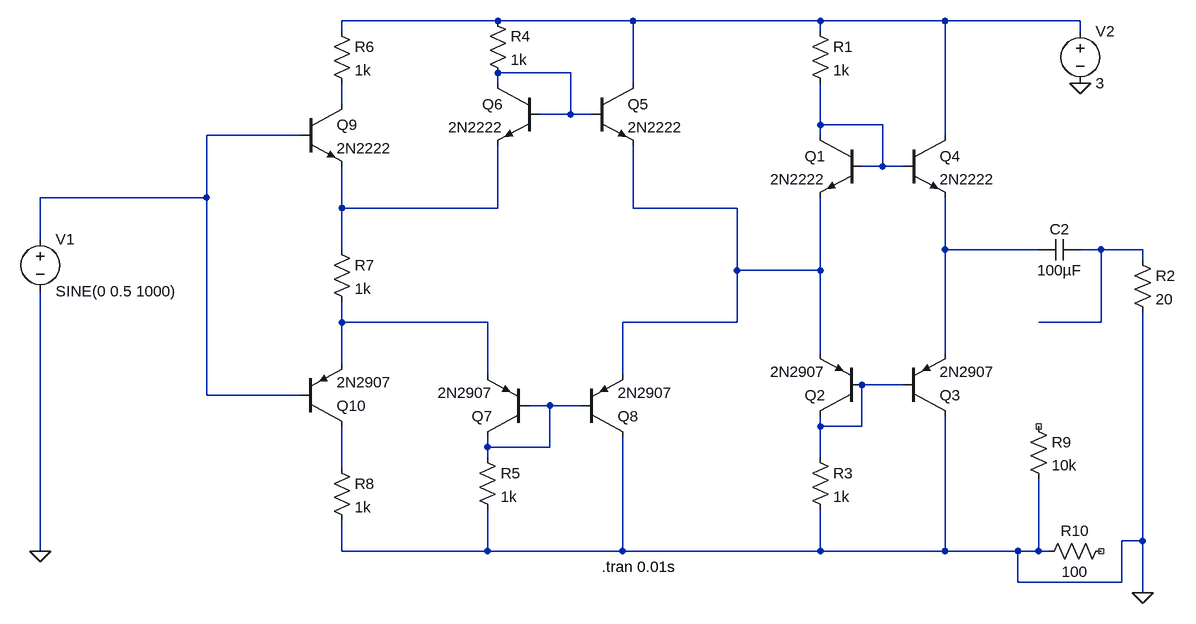
[diagram p0: schematic Final-PowerAmp.asc]
Final-PowerAmp.asc, the LTspice schematic file:
Version 4
SHEET 1 1160 800
WIRE -256 -96 -496 -96
WIRE -48 -96 -256 -96
WIRE 240 -96 -48 -96
WIRE 432 -96 240 -96
WIRE 640 -96 432 -96
WIRE -496 -80 -496 -96
WIRE 240 -80 240 -96
WIRE 640 -80 640 -96
WIRE -144 -16 -256 -16
WIRE -256 0 -256 -16
WIRE -48 0 -48 -96
WIRE -496 32 -496 0
WIRE -144 48 -144 -16
WIRE -144 48 -192 48
WIRE -112 48 -144 48
WIRE 240 64 240 0
WIRE 336 64 240 64
WIRE -560 80 -704 80
WIRE 240 80 240 64
WIRE 432 80 432 -96
WIRE 336 128 336 64
WIRE 336 128 304 128
WIRE 368 128 336 128
WIRE -704 176 -704 80
WIRE -704 176 -960 176
WIRE -496 192 -496 128
WIRE -256 192 -256 96
WIRE -256 192 -496 192
WIRE -48 192 -48 96
WIRE 112 192 -48 192
WIRE -960 240 -960 176
WIRE -496 256 -496 192
WIRE 432 256 432 176
WIRE 576 256 432 256
WIRE 672 256 640 256
WIRE 736 256 672 256
WIRE 736 272 736 256
WIRE 112 288 112 192
WIRE 240 288 240 176
WIRE 240 288 112 288
WIRE -496 368 -496 336
WIRE -272 368 -496 368
WIRE 112 368 112 288
WIRE 112 368 -64 368
WIRE 672 368 672 256
WIRE 672 368 576 368
WIRE 240 416 240 288
WIRE 432 416 432 256
WIRE -496 432 -496 368
WIRE -272 448 -272 368
WIRE -64 448 -64 368
WIRE 368 464 304 464
WIRE -704 480 -704 176
WIRE -560 480 -704 480
WIRE -176 496 -208 496
WIRE -128 496 -176 496
WIRE 240 528 240 512
WIRE 304 528 304 464
WIRE 304 528 240 528
WIRE -272 560 -272 544
WIRE -176 560 -176 496
WIRE -176 560 -272 560
WIRE -272 576 -272 560
WIRE 240 576 240 528
WIRE -496 592 -496 528
WIRE 736 704 736 352
WIRE 736 704 704 704
WIRE -960 720 -960 320
WIRE -496 720 -496 672
WIRE -272 720 -272 656
WIRE -272 720 -496 720
WIRE -64 720 -64 544
WIRE -64 720 -272 720
WIRE 240 720 240 656
WIRE 240 720 -64 720
WIRE 432 720 432 512
WIRE 432 720 240 720
WIRE 544 720 432 720
WIRE 576 720 576 608
WIRE 576 720 544 720
WIRE 592 720 576 720
WIRE 544 768 544 720
WIRE 704 768 704 704
WIRE 704 768 544 768
WIRE 736 784 736 704
FLAG 640 0 0
FLAG -960 720 0
FLAG 736 784 0
SYMBOL voltage -960 224 R0
WINDOW 123 0 0 Left 0
WINDOW 39 0 0 Left 0
SYMATTR InstName V1
SYMATTR Value SINE(0 0.5 1000)
SYMBOL res 224 -96 R0
SYMATTR InstName R1
SYMATTR Value 1k
SYMBOL npn 304 80 M0
SYMATTR InstName Q1
SYMATTR Value 2N2222
SYMBOL npn 368 80 R0
SYMATTR InstName Q4
SYMATTR Value 2N2222
SYMBOL cap 640 240 R90
WINDOW 0 0 32 VBottom 2
WINDOW 3 32 32 VTop 2
SYMATTR InstName C2
SYMATTR Value 100µF
SYMBOL res 720 256 R0
SYMATTR InstName R2
SYMATTR Value 20
SYMBOL pnp 304 512 R180
SYMATTR InstName Q2
SYMATTR Value 2N2907
SYMBOL pnp 368 512 M180
SYMATTR InstName Q3
SYMATTR Value 2N2907
SYMBOL res 224 560 R0
SYMATTR InstName R3
SYMATTR Value 1k
SYMBOL voltage 640 -96 R0
WINDOW 123 0 0 Left 0
WINDOW 39 0 0 Left 0
SYMATTR InstName V2
SYMATTR Value 3
SYMBOL npn -112 0 R0
SYMATTR InstName Q5
SYMATTR Value 2N2222
SYMBOL npn -192 0 M0
SYMATTR InstName Q6
SYMATTR Value 2N2222
SYMBOL pnp -208 544 R180
SYMATTR InstName Q7
SYMATTR Value 2N2907
SYMBOL pnp -128 544 M180
SYMATTR InstName Q8
SYMATTR Value 2N2907
SYMBOL res -272 -112 R0
SYMATTR InstName R4
SYMATTR Value 1k
SYMBOL res -288 560 R0
SYMATTR InstName R5
SYMATTR Value 1k
SYMBOL npn -560 32 R0
SYMATTR InstName Q9
SYMATTR Value 2N2222
SYMBOL pnp -560 528 M180
SYMATTR InstName Q10
SYMATTR Value 2N2907
SYMBOL res -512 -96 R0
SYMATTR InstName R6
SYMATTR Value 1k
SYMBOL res -512 240 R0
SYMATTR InstName R7
SYMATTR Value 1k
SYMBOL res -512 576 R0
SYMATTR InstName R8
SYMATTR Value 1k
SYMBOL res 560 512 R0
SYMATTR InstName R9
SYMATTR Value 10k
SYMBOL res 688 704 R90
WINDOW 0 0 56 VBottom 2
WINDOW 3 32 56 VTop 2
SYMATTR InstName R10
SYMATTR Value 100
TEXT -96 744 Left 2 !.tran 0.01s

The netlist it stands for:
* Final-PowerAmp.asc
V1 N005 0 SINE(0 0.5 1000)
R1 N001 N004 1k
Q1 N004 N004 N007 0 2N2222
Q4 N001 N004 N008 0 2N2222
C2 N009 N008 100µF
R2 N009 0 20
Q2 N011 N011 N007 0 2N2907
Q3 0 N011 N008 0 2N2907
R3 N011 0 1k
V2 N001 0 3
Q5 N001 N002 N007 0 2N2222
Q6 N002 N002 N006 0 2N2222
Q7 N012 N012 N010 0 2N2907
Q8 0 N012 N007 0 2N2907
R4 N001 N002 1k
R5 N012 0 1k
Q9 N003 N005 N006 0 2N2222
Q10 N013 N005 N010 0 2N2907
R6 N001 N003 1k
R7 N006 N010 1k
R8 N013 0 1k
R9 NC_01 0 10k
R10 NC_02 0 100
.model NPN NPN
.model PNP PNP
.lib standard.bjt
.tran 0.01s
.backanno
.end